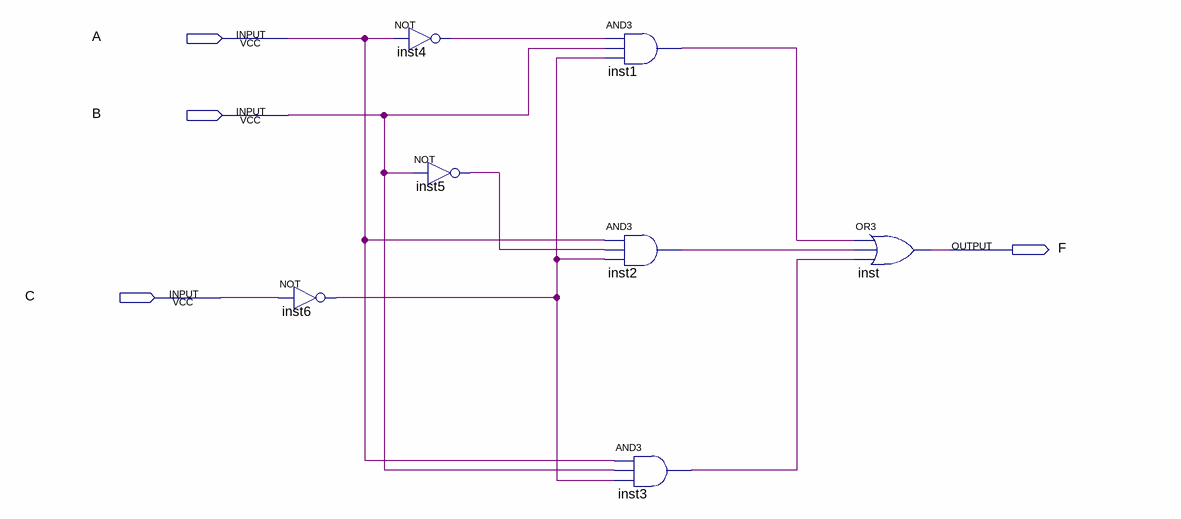
[diagram p0: schematic sheet]
// Quartus schematic lab2step1.bdf as structural Verilog: 7 symbols, 4 pins
module lab2step1 (
  input  A,
  input  B,
  input  C,
  output F
);

  wire inst1_out, inst2_out, inst3_out, inst4_out, inst5_out, inst6_out;

  not inst6 (inst6_out, C);
  not inst4 (inst4_out, A);
  not inst5 (inst5_out, B);
  and inst1 (inst1_out, inst4_out, B, inst6_out);
  and inst2 (inst2_out, A, inst5_out, inst6_out);
  and inst3 (inst3_out, A, B, inst6_out);
  or inst (F, inst1_out, inst2_out, inst3_out);
endmodule
